# EAGLE schematic one_side (EAGLE 5.10)

## Sheet 1 of 3
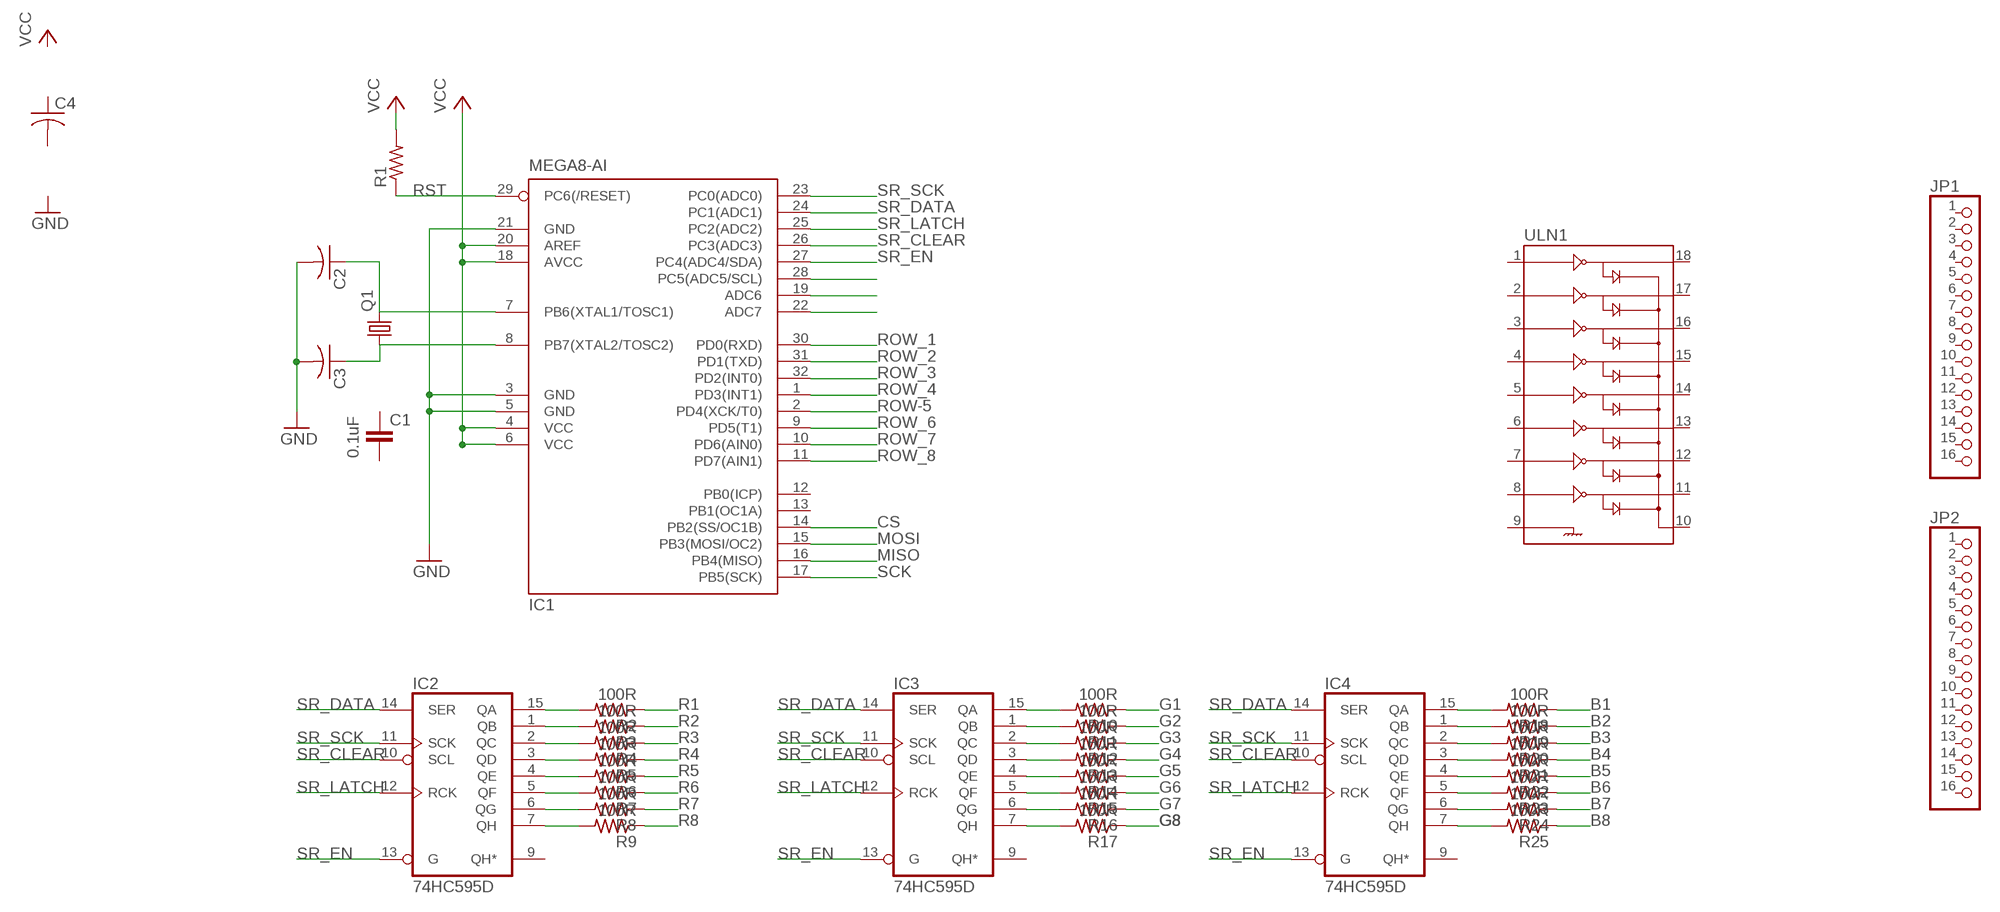
[diagram p0: schematic, sheet 1]

### Parts
C1  0.1uF  CAP0603-CAP  [0603-CAP]
C2  C-USC0805K  [C0805K]
C3  C-USC0805K  [C0805K]
C4  C-USC0805K  [C0805K]
IC1  MEGA8-AI  [TQFP32-08]
IC2  74HC595D  [SO16]
IC3  74HC595D  [SO16]
IC4  74HC595D  [SO16]
JP1  PINHD-1X16  [1X16]
JP2  PINHD-1X16  [1X16]
Q1  CRYSTALCTS406  [CTS406]
R1  R-US_R0805  [R0805]
R2  100R  R-US_R0805  [R0805]
R3  100R  R-US_R0805  [R0805]
R4  100R  R-US_R0805  [R0805]
R5  100R  R-US_R0805  [R0805]
R6  100R  R-US_R0805  [R0805]
R7  100R  R-US_R0805  [R0805]
R8  100R  R-US_R0805  [R0805]
R9  100R  R-US_R0805  [R0805]
R10  100R  R-US_R0805  [R0805]
R11  100R  R-US_R0805  [R0805]
R12  100R  R-US_R0805  [R0805]
R13  100R  R-US_R0805  [R0805]
R14  100R  R-US_R0805  [R0805]
R15  100R  R-US_R0805  [R0805]
R16  100R  R-US_R0805  [R0805]
R17  100R  R-US_R0805  [R0805]
R18  100R  R-US_R0805  [R0805]
R19  100R  R-US_R0805  [R0805]
R20  100R  R-US_R0805  [R0805]
R21  100R  R-US_R0805  [R0805]
R22  100R  R-US_R0805  [R0805]
R23  100R  R-US_R0805  [R0805]
R24  100R  R-US_R0805  [R0805]
R25  100R  R-US_R0805  [R0805]
ULN1  ULN2803SOIC  [SO018]

### Nets
B1: R18.1 ; also sheet 3
B2: R19.1 ; also sheet 3
B3: R20.1 ; also sheet 3
B4: R21.1 ; also sheet 3
B5: R22.1 ; also sheet 3
B6: R23.1 ; also sheet 3
B7: R24.1 ; also sheet 3
B8: R25.1 ; also sheet 3
CS: IC1.14(PB2(SS/OC1B))
G1: R10.1 ; also sheet 3
G2: R11.1 ; also sheet 3
G3: R12.1 ; also sheet 3
G4: R13.1 ; also sheet 3
G5: R14.1 ; also sheet 3
G6: R15.1 ; also sheet 3
G7: R16.1 ; also sheet 3
G8: R17.1 ; also sheet 3
GND: C2.2 C3.2 IC1.3(GND) IC1.5(GND) IC1.21(GND) ; also sheet 2
MISO: IC1.16(PB4(MISO)) ; also sheet 2
MOSI: IC1.15(PB3(MOSI/OC2)) ; also sheet 2
N$1: C2.1 IC1.7(PB6(XTAL1/TOSC1)) Q1.3
N$2: C3.1 IC1.8(PB7(XTAL2/TOSC2)) Q1.1
N$8: IC2.15(QA) R2.2
N$9: IC2.1(QB) R3.2
N$10: IC2.2(QC) R4.2
N$11: IC2.3(QD) R5.2
N$12: IC2.4(QE) R6.2
N$13: IC2.5(QF) R7.2
N$14: IC2.6(QG) R8.2
N$15: IC1.28(PC5(ADC5/SCL))
N$16: IC1.19(ADC6)
N$17: IC1.22(ADC7)
N$18: IC2.7(QH) R9.2
N$22: IC3.15(QA) R10.2
N$23: IC3.1(QB) R11.2
N$24: IC3.2(QC) R12.2
N$25: IC3.3(QD) R13.2
N$26: IC3.4(QE) R14.2
N$27: IC3.5(QF) R15.2
N$28: IC3.6(QG) R16.2
N$29: IC3.7(QH) R17.2
N$38: IC4.15(QA) R18.2
N$39: IC4.1(QB) R19.2
N$40: IC4.2(QC) R20.2
N$41: IC4.3(QD) R21.2
N$42: IC4.4(QE) R22.2
N$43: IC4.5(QF) R23.2
N$44: IC4.6(QG) R24.2
N$45: IC4.7(QH) R25.2
R1: R2.1 ; also sheet 3
R2: R3.1 ; also sheet 3
R3: R4.1 ; also sheet 3
R4: R5.1 ; also sheet 3
R5: R6.1 ; also sheet 3
R6: R7.1 ; also sheet 3
R7: R8.1 ; also sheet 3
R8: R9.1 ; also sheet 3
ROW-5: IC1.2(PD4(XCK/T0))
ROW_1: IC1.30(PD0(RXD))
ROW_2: IC1.31(PD1(TXD))
ROW_3: IC1.32(PD2(INT0))
ROW_4: IC1.1(PD3(INT1))
ROW_6: IC1.9(PD5(T1))
ROW_7: IC1.10(PD6(AIN0))
ROW_8: IC1.11(PD7(AIN1))
RST: IC1.29(PC6(/RESET)) R1.1 ; also sheet 2
SCK: IC1.17(PB5(SCK)) ; also sheet 2
SR_CLEAR: IC1.26(PC3(ADC3)) IC2.10(SCL) IC3.10(SCL) IC4.10(SCL) ; also sheet 3
SR_DATA: IC1.24(PC1(ADC1)) IC2.14(SER) IC3.14(SER) IC4.14(SER) ; also sheet 3
SR_EN: IC1.27(PC4(ADC4/SDA)) IC2.13(G) IC3.13(G) IC4.13(G) ; also sheet 3
SR_LATCH: IC1.25(PC2(ADC2)) IC2.12(RCK) IC3.12(RCK) IC4.12(RCK) ; also sheet 3
SR_SCK: IC1.23(PC0(ADC0)) IC2.11(SCK) IC3.11(SCK) IC4.11(SCK) ; also sheet 3
VCC: IC1.4(VCC) IC1.6(VCC) IC1.18(AVCC) IC1.20(AREF) R1.2 ; also sheet 2
Unconnected: C1.1 C1.2 C4.1 C4.2 IC1.12(PB0(ICP)) IC1.13(PB1(OC1A)) IC2.9(QH*) IC3.9(QH*) IC4.9(QH*) JP1.1 JP1.2 JP1.3 JP1.4 JP1.5 JP1.6 JP1.7 JP1.8 JP1.9 JP1.10 JP1.11 JP1.12 JP1.13 JP1.14 JP1.15 JP1.16 JP2.1 JP2.2 JP2.3 JP2.4 JP2.5 JP2.6 JP2.7 JP2.8 JP2.9 JP2.10 JP2.11 JP2.12 JP2.13 JP2.14 JP2.15 JP2.16 ULN1.1 ULN1.2 ULN1.3 ULN1.4 ULN1.5 ULN1.6 ULN1.7 ULN1.8 ULN1.9 ULN1.10 ULN1.11 ULN1.12 ULN1.13 ULN1.14 ULN1.15 ULN1.16 ULN1.17 ULN1.18

## Sheet 2 of 3
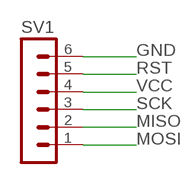
[diagram p1: schematic, sheet 2]

### Parts
SV1  MA06-1  [MA06-1]

### Nets
GND: SV1.6 ; also sheet 1
MISO: SV1.2 ; also sheet 1
MOSI: SV1.1 ; also sheet 1
RST: SV1.5 ; also sheet 1
SCK: SV1.3 ; also sheet 1
VCC: SV1.4 ; also sheet 1

## Sheet 3 of 3
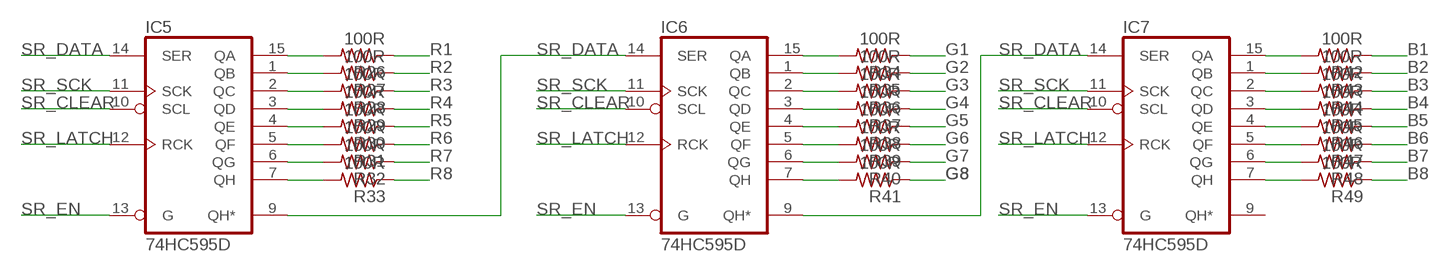
[diagram p2: schematic, sheet 3]

### Parts
IC5  74HC595D  [SO16]
IC6  74HC595D  [SO16]
IC7  74HC595D  [SO16]
R26  100R  R-US_R0805  [R0805]
R27  100R  R-US_R0805  [R0805]
R28  100R  R-US_R0805  [R0805]
R29  100R  R-US_R0805  [R0805]
R30  100R  R-US_R0805  [R0805]
R31  100R  R-US_R0805  [R0805]
R32  100R  R-US_R0805  [R0805]
R33  100R  R-US_R0805  [R0805]
R34  100R  R-US_R0805  [R0805]
R35  100R  R-US_R0805  [R0805]
R36  100R  R-US_R0805  [R0805]
R37  100R  R-US_R0805  [R0805]
R38  100R  R-US_R0805  [R0805]
R39  100R  R-US_R0805  [R0805]
R40  100R  R-US_R0805  [R0805]
R41  100R  R-US_R0805  [R0805]
R42  100R  R-US_R0805  [R0805]
R43  100R  R-US_R0805  [R0805]
R44  100R  R-US_R0805  [R0805]
R45  100R  R-US_R0805  [R0805]
R46  100R  R-US_R0805  [R0805]
R47  100R  R-US_R0805  [R0805]
R48  100R  R-US_R0805  [R0805]
R49  100R  R-US_R0805  [R0805]

### Nets
B1: R42.1 ; also sheet 1
B2: R43.1 ; also sheet 1
B3: R44.1 ; also sheet 1
B4: R45.1 ; also sheet 1
B5: R46.1 ; also sheet 1
B6: R47.1 ; also sheet 1
B7: R48.1 ; also sheet 1
B8: R49.1 ; also sheet 1
G1: R34.1 ; also sheet 1
G2: R35.1 ; also sheet 1
G3: R36.1 ; also sheet 1
G4: R37.1 ; also sheet 1
G5: R38.1 ; also sheet 1
G6: R39.1 ; also sheet 1
G7: R40.1 ; also sheet 1
G8: R41.1 ; also sheet 1
N$3: IC5.15(QA) R26.2
N$4: IC5.1(QB) R27.2
N$5: IC5.2(QC) R28.2
N$6: IC5.3(QD) R29.2
N$7: IC5.4(QE) R30.2
N$19: IC5.5(QF) R31.2
N$20: IC5.6(QG) R32.2
N$21: IC5.7(QH) R33.2
N$30: IC6.15(QA) R34.2
N$31: IC6.1(QB) R35.2
N$32: IC6.2(QC) R36.2
N$33: IC6.3(QD) R37.2
N$34: IC6.4(QE) R38.2
N$35: IC6.5(QF) R39.2
N$36: IC6.6(QG) R40.2
N$37: IC6.7(QH) R41.2
N$46: IC7.15(QA) R42.2
N$47: IC7.1(QB) R43.2
N$48: IC7.2(QC) R44.2
N$49: IC7.3(QD) R45.2
N$50: IC7.4(QE) R46.2
N$51: IC7.5(QF) R47.2
N$52: IC7.6(QG) R48.2
N$53: IC7.7(QH) R49.2
R1: R26.1 ; also sheet 1
R2: R27.1 ; also sheet 1
R3: R28.1 ; also sheet 1
R4: R29.1 ; also sheet 1
R5: R30.1 ; also sheet 1
R6: R31.1 ; also sheet 1
R7: R32.1 ; also sheet 1
R8: R33.1 ; also sheet 1
SR_CLEAR: IC5.10(SCL) IC6.10(SCL) IC7.10(SCL) ; also sheet 1
SR_DATA: IC5.9(QH*) IC5.14(SER) IC6.9(QH*) IC6.14(SER) IC7.14(SER) ; also sheet 1
SR_EN: IC5.13(G) IC6.13(G) IC7.13(G) ; also sheet 1
SR_LATCH: IC5.12(RCK) IC6.12(RCK) IC7.12(RCK) ; also sheet 1
SR_SCK: IC5.11(SCK) IC6.11(SCK) IC7.11(SCK) ; also sheet 1
Unconnected: IC7.9(QH*)

## Power pins joined to a net without a drawn wire
GND: IC2.8(GND) IC3.8(GND) IC4.8(GND) IC5.8(GND) IC6.8(GND) IC7.8(GND)
VCC: IC2.16(VCC) IC3.16(VCC) IC4.16(VCC) IC5.16(VCC) IC6.16(VCC) IC7.16(VCC)

## Library data of the parts
C1 = SparkFun:CAP: Capacitor Standard 0603 ceramic capacitor, and 0.1" leaded capacitor.
C2-C4 = rcl:C-US: CAPACITOR, American symbol
IC1 = atmel:MEGA8: MICROCONTROLLER 8 Kbytes FLASH, 1 kbytes SRAM, 512 bytes EEPROM, USART, 6-channel 10 bit ADC, 2-channel 8 bit ADC Pin compatible with Atmega48, ATMega88, ATMega168 Source: avr.lbr
IC2-IC7 = 74xx-eu:74*595: 8-bit SHIFT REGISTER, output latch
JP1 JP2 = pinhead:PINHD-1X16: PIN HEADER
Q1 = crystal:CRYSTAL: CRYSTAL
R1-R49 = resistor:R-US_: RESISTOR, American symbol
SV1 = NSL:MA06-1: PIN HEADER
ULN1 = SparkFun:ULN2803: Darlington Driver ULN2803 Darlington array. 500mA max per channel, 8-channel package. Spark Fun Electronics SKU : COM-00312

## Net classes
1 LED: width 0.203 mm